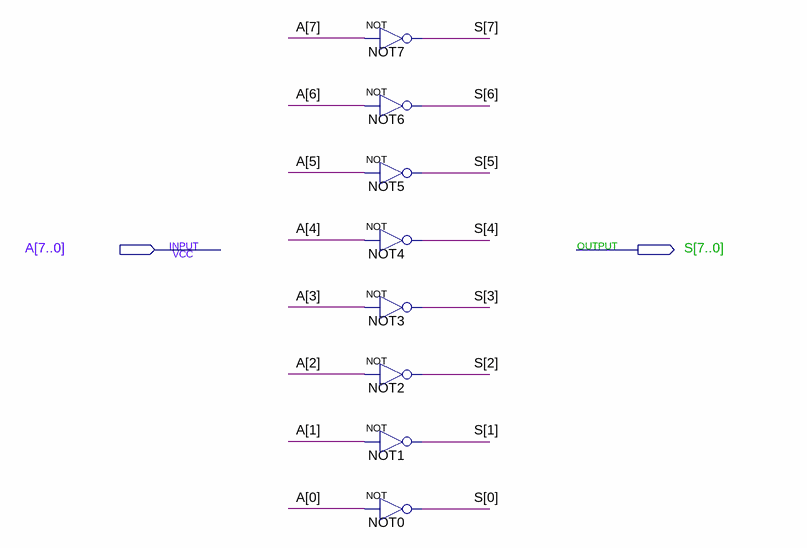
[diagram p0: schematic sheet]
// Quartus schematic NOT_8b.bdf as structural Verilog: 8 symbols, 2 pins
module NOT_8b (
  input  [7:0] A,
  output [7:0] S
);

  not NOT7 (S[7], A[7]);
  not NOT6 (S[6], A[6]);
  not NOT5 (S[5], A[5]);
  not NOT4 (S[4], A[4]);
  not NOT3 (S[3], A[3]);
  not NOT2 (S[2], A[2]);
  not NOT1 (S[1], A[1]);
  not NOT0 (S[0], A[0]);
endmodule
